# Altium schematic sheet 远程开机卡.schdoc
size 261 x 182 mm; Name: A_Customize; Symbol: A_Customize; Device: A_Customize; @Project Name: WIFI远程电脑开机卡; REV: V1.0; Date: 2024-01-05; Sheet: 1/1; Draw By: Maxic; Company: Your Company; Convert to PCB: yes; Add into BOM: yes
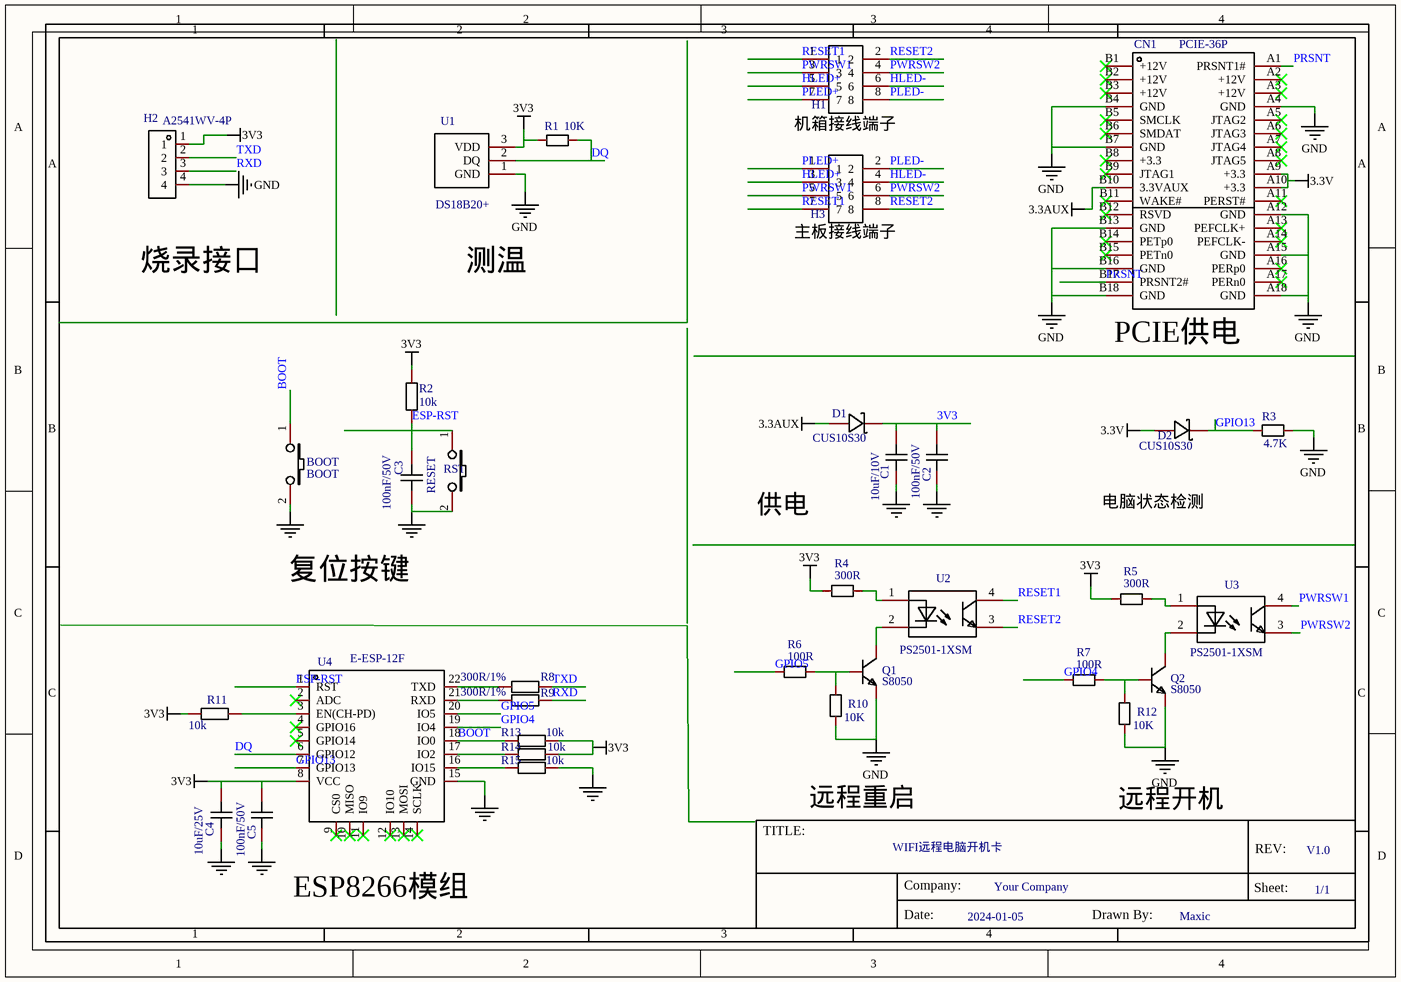
[diagram p0: 远程开机卡.schdoc]

## Parts
BOOT  BOOT  [轻触开关]
C1  10uF/10V  [C  0603]
C2  100nF/50V  [C  0603]
C3  100nF/50V  [C  0603]
C4  10uF/25V  [C  0603]
C5  100nF/50V  [C  0603]
CN1  PCIE-36P  [PCIE 1X]
D1  CUS10S30  [SOD-323]
D2  CUS10S30  [SOD-323]
H1  机箱接线端子  [排针排母2*4P]  (value not drawn)
H2  A2541WV-4P  [HDR-TH_4P-P2.54-V-M]
H3  主板接线端子  [排针排母2*4P]  (value not drawn)
Q1  S8050  [SOT-23-3]
Q2  S8050  [SOT-23-3]
R1  10K  [R 0603]
R2  10k  [R 0603]
R3  4.7K  [R 0603]
R4  300R  [R 0603]
R5  300R  [R 0603]
R6  100R  [R 0603]
R7  100R  [R 0603]
R8  300R/1%  [R 0603]
R9  300R/1%  [R 0603]
R10  10K  [R 0603]
R11  10k  [R 0603]
R12  10K  [R 0603]
R13  10k  [R 0603]
R14  10k  [R 0603]
R15  10k  [R 0603]
RST  RESET  [轻触开关]
U1  DS18B20+  [TO-92-3_L4.9-W3.7-P1.27-L]
U2  PS2501-1XSM  [SOP-4_L6.5-W4.6-P2.54-LS10.2-BL]
U3  PS2501-1XSM  [SOP-4_L6.5-W4.6-P2.54-LS10.2-BL]
U4  E-ESP-12F  [J-ESP-12F]

## Nets
3.3AUX: CN1.B10(3.3VAUX) D1.2(A)
3.3V: CN1.A9(+3.3) CN1.A10(+3.3) D2.2(A)
3V3: C1.2 C2.2 C4.2 C5.2 D1.1(K) H2.1 R1.2 R2.1 R4.1 R5.1 R11.2 R13.2 R14.1 U1.3(VDD) U4.8(VCC)
GND: BOOT.2 C1.1 C2.1 C3.1 C4.1 C5.1 CN1.A4(GND) CN1.A12(GND) CN1.A15(GND) CN1.A18(GND) CN1.B4(GND) CN1.B7(GND) CN1.B13(GND) CN1.B16(GND) CN1.B18(GND) H2.4 Q1.2 Q2.2 R3.2 R10.2 R12.2 R15.1 RST.2 U1.1(GND) U4.15(GND)
BOOT: BOOT.1 R13.1 U4.18(IO0)
DQ: R1.1 U1.2(DQ) U4.6(GPIO12)
ESP-RST: C3.2 R2.2 RST.1 U4.1(RST)
GPIO4: R7.1 U4.19(IO4)
GPIO5: R6.1 U4.20(IO5)
GPIO13: D2.1(K) R3.1 U4.7(GPIO13)
HLED+: H1.5 H3.3
HLED-: H1.6 H3.4
PLED+: H1.7 H3.1
PLED-: H1.8 H3.2
PRSNT: CN1.A1(PRSNT1#) CN1.B17(PRSNT2#)
PWRSW1: H1.3 H3.5 U3.4(Collector)
PWRSW2: H1.4 H3.6 U3.3(Emitter)
RESET1: H1.1 H3.7 U2.4(Collector)
RESET2: H1.2 H3.8 U2.3(Emitter)
RXD: H2.3 R9.1
TXD: H2.2 R8.1
NetQ1_1: Q1.1 R6.2 R10.1
NetQ1_3: Q1.3 U2.2(Cathode)
NetQ2_1: Q2.1 R7.2 R12.1
NetQ2_3: Q2.3 U3.2(Cathode)
NetR4_2: R4.2 U2.1(Anode)
NetR5_2: R5.2 U3.1(Anode)
NetR8_2: R8.2 U4.22(TXD)
NetR9_2: R9.2 U4.21(RXD)
NetR11_1: R11.1 U4.3(EN(CH-PD))
NetR14_2: R14.2 U4.17(IO2)
NetR15_2: R15.2 U4.16(IO15)

Not connected (* = marked no-connect by the designer): CN1 A2(+12V)* A3(+12V)* A5(JTAG2)* A6(JTAG3)* A7(JTAG4)* A8(JTAG5)* A11(PERST#)* A13(PEFCLK+)* A14(PEFCLK-)* A16(PERp0)* A17(PERn0)* B1(+12V)* B2(+12V)* B3(+12V)* B5(SMCLK)* B6(SMDAT)* B8(+3.3)* B9(JTAG1)* B11(WAKE#)* B12(RSVD)* B14(PETp0)* B15(PETn0)*; U4 2(ADC)* 4(GPIO16)* 5(GPIO14)* 9(CS0)* 10(MISO)* 11(IO9)* 12(IO10)* 13(MOSI)* 14(SCLK)*

## Notes on the sheet
- (near H1) 机箱接线端子
- (near H3) 主板接线端子
- 烧录接口
- 测温
- (near CN1) PCIE供电
- 供电
- 电脑状态检测
- 复位按键
- 远程重启
- 远程开机
- ESP8266模组
- 1
- 2
- 3
- 4
- A
- B
- C
- TITLE:
- WIFI远程电脑开机卡
- REV:
- V1.0
- Date:
- Company:
- 2024-01-05
- Your Company
- Drawn By:
- Maxic
- Sheet:
- 1/1

## Library data of the parts
BOOT = BOOT: Manufacturer: HRO; Manufacturer Part: K2-1107ST; Convert to PCB: yes; Name: BOOT; Symbol: BOOT; Device: BOOT; Supplier Part: C118141; Supplier: LCSC; Add into BOM: yes
C1 = 10uF/10V: Manufacturer: Murata Electronics; Manufacturer Part: GRM188B31A106ME69D; Convert to PCB: yes; Name: 10uF/10V; Symbol: 10uF/10V; Device: 10uF/10V; Supplier: LCSC; Supplier Part: C162265; Add into BOM: yes
C2 C3 C5 = 100nF/50V: Manufacturer: Darfon Elec; Manufacturer Part: C1608X7R104KGTS; Convert to PCB: yes; Name: 100nF/50V; Symbol: 100nF/50V; Device: 100nF/50V; Supplier: LCSC; Supplier Part: C335111; Add into BOM: yes
C4 = 10uF/25V: Manufacturer: TDK; Manufacturer Part: C1608X5R1E106MT000E; Convert to PCB: yes; Name: 10uF/25V; Symbol: 10uF/25V; Device: 10uF/25V; Supplier: LCSC; Supplier Part: C76614; Add into BOM: yes
CN1 = PCIE-36P: Manufacturer: UMAX; Convert to PCB: yes; Name: PCIE-36P; Symbol: PCIE-36P; Device: PCIE-36P; Supplier: LCSC; Supplier Part: C194068; Add into BOM: yes
D1 D2 = CUS10S30: Manufacturer: TOSHIBA; Manufacturer Part: CUS10S30 H3F; Convert to PCB: yes; SMT Type: Extend; Name: CUS10S30; Symbol: CUS10S30; Device: CUS10S30; Supplier: LCSC; Supplier Part: C146335; JLCPCB Part Class: Extend; Add into BOM: yes
H1 = 机箱接线端子: Manufacturer: Shenzhen Cankemeng; Convert to PCB: yes; Name: 机箱接线端子; Symbol: 机箱接线端子; Device: 机箱接线端子; Supplier: LCSC; Supplier Part: C169817; Manufacturer Part: -; Add into BOM: yes
H2 = A2541WV-4P: Manufacturer: CJT(长江连接器); Convert to PCB: yes; Name: A2541WV-4P; Symbol: A2541WV-4P; Device: A2541WV-4P; Supplier: LCSC; Supplier Part: C225479; Manufacturer Part: A2541WV-4P; JLCPCB Part Class: Extended Part; Add into BOM: yes
H3 = 主板接线端子: Manufacturer: Shenzhen Cankemeng; Convert to PCB: yes; Name: 主板接线端子; Symbol: 主板接线端子; Device: 主板接线端子; Supplier: LCSC; Supplier Part: C169817; Manufacturer Part: -; Add into BOM: yes
Q1 Q2 = S8050: Manufacturer: CJ; Convert to PCB: yes; Name: S8050; Symbol: S8050; Device: S8050; Supplier Part: C2146; Supplier: LCSC; Manufacturer Part: S8050; Add into BOM: yes
R1 = 10K: Manufacturer: ResistorToday; Convert to PCB: yes; Name: 10K; Symbol: 10K; Device: 10K; Supplier: LCSC; Supplier Part: C365140; Add into BOM: yes
R2 R11 R13-R15 = 10k/1%: Manufacturer: KOA Speer Elec; Manufacturer Part: RK73G1JTTD1002F; Convert to PCB: yes; Name: 10k; Symbol: 10k/1%; Device: 10k/1%; Supplier: LCSC; Supplier Part: C362180; Add into BOM: yes
R3 = 4.7K: Manufacturer: PANASONIC; Convert to PCB: yes; Name: 4.7K; Symbol: 4.7K; Device: 4.7K; Supplier: LCSC; Supplier Part: C118155; Add into BOM: yes
R4 R5 = 300R: Manufacturer: ResistorToday; Convert to PCB: yes; Name: 300R; Symbol: 300R; Device: 300R; Supplier: LCSC; Supplier Part: C365140; Add into BOM: yes
R6 R7 = 100R: Manufacturer: YAGEO; Convert to PCB: yes; Name: 100R; Symbol: 100R; Device: 100R; Supplier: LCSC; Supplier Part: C125923; Add into BOM: yes
R8 R9 = 300R/1%: Manufacturer: YAGEO; Manufacturer Part: AC0603FR-07300RL; Convert to PCB: yes; Name: 300R/1%; Symbol: 300R/1%; Device: 300R/1%; Supplier: LCSC; Supplier Part: C125916; Add into BOM: yes
R10 R12 = 10K: Manufacturer: Stackpole Elec; Convert to PCB: yes; Name: 10K; Symbol: 10K; Device: 10K; Supplier: LCSC; Supplier Part: C238881; Add into BOM: yes
RST = RESET: Manufacturer: HRO; Manufacturer Part: K2-1107ST; Convert to PCB: yes; Name: RESET; Symbol: RESET; Device: RESET; Supplier Part: C118141; Supplier: LCSC; Add into BOM: yes
U1 = DS18B20+: Manufacturer: ADI(亚德诺)/MAXIM(美信); Convert to PCB: yes; Name: DS18B20+; Symbol: DS18B20+; Device: DS18B20+; Supplier: LCSC; Manufacturer Part: DS18B20+; Supplier Part: C9753; JLCPCB Part Class: Extended Part; Add into BOM: yes
U2 U3 = PS2501-1XSM: Manufacturer: ISOCOM(英国安数光); Convert to PCB: yes; Name: PS2501-1XSM; Symbol: PS2501-1XSM; Device: PS2501-1XSM; Supplier: LCSC; Supplier Part: C132781; Manufacturer Part: PS2501-1XSM; JLCPCB Part Class: Extended Part; Add into BOM: yes
U4 = E-ESP-12F: Manufacturer Part: ESP-12F(ESP8266MOD); Manufacturer: Ai-Thinker; Convert to PCB: yes; Name: E-ESP-12F; Symbol: E-ESP-12F; Device: E-ESP-12F; Supplier Part: C82891; Supplier: LCSC; Add into BOM: yes